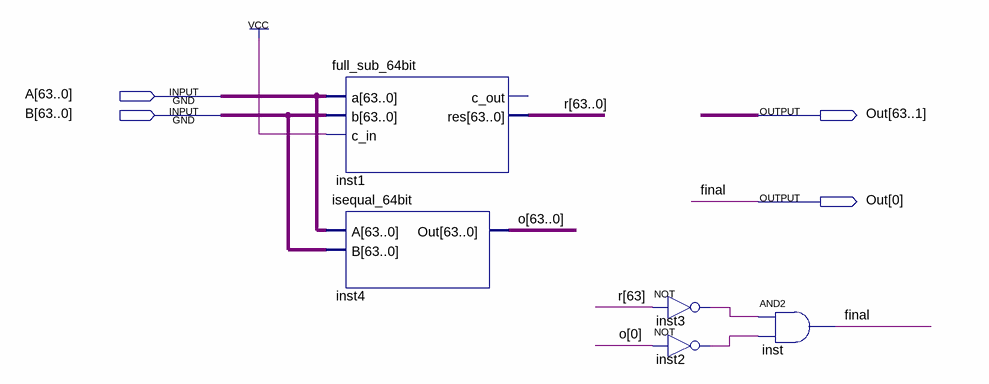
[diagram p0: schematic sheet]
// Quartus schematic isgreater_64bit.bdf as structural Verilog: 5 symbols, 4 pins
module isgreater_64bit (
  input  [63:0] A,
  input  [63:0] B,
  output [63:0] Out
);

  wire inst2_out, inst3_out;
  wire [63:0] o, r;

  full_sub_64bit inst1 (.a(A), .b(B), .c_in(1'b1), .res(r));  // open: c_out
  isequal_64bit inst4 (.A(A), .B(B), .Out(o));
  not inst3 (inst3_out, r[63]);
  not inst2 (inst2_out, o[0]);
  and inst (Out[0], inst3_out, inst2_out);

  // Other names for the same wires on the sheet: final = Out[0]
endmodule
